# EAGLE design encoder_module_boardedge (EAGLE 6.5.0)
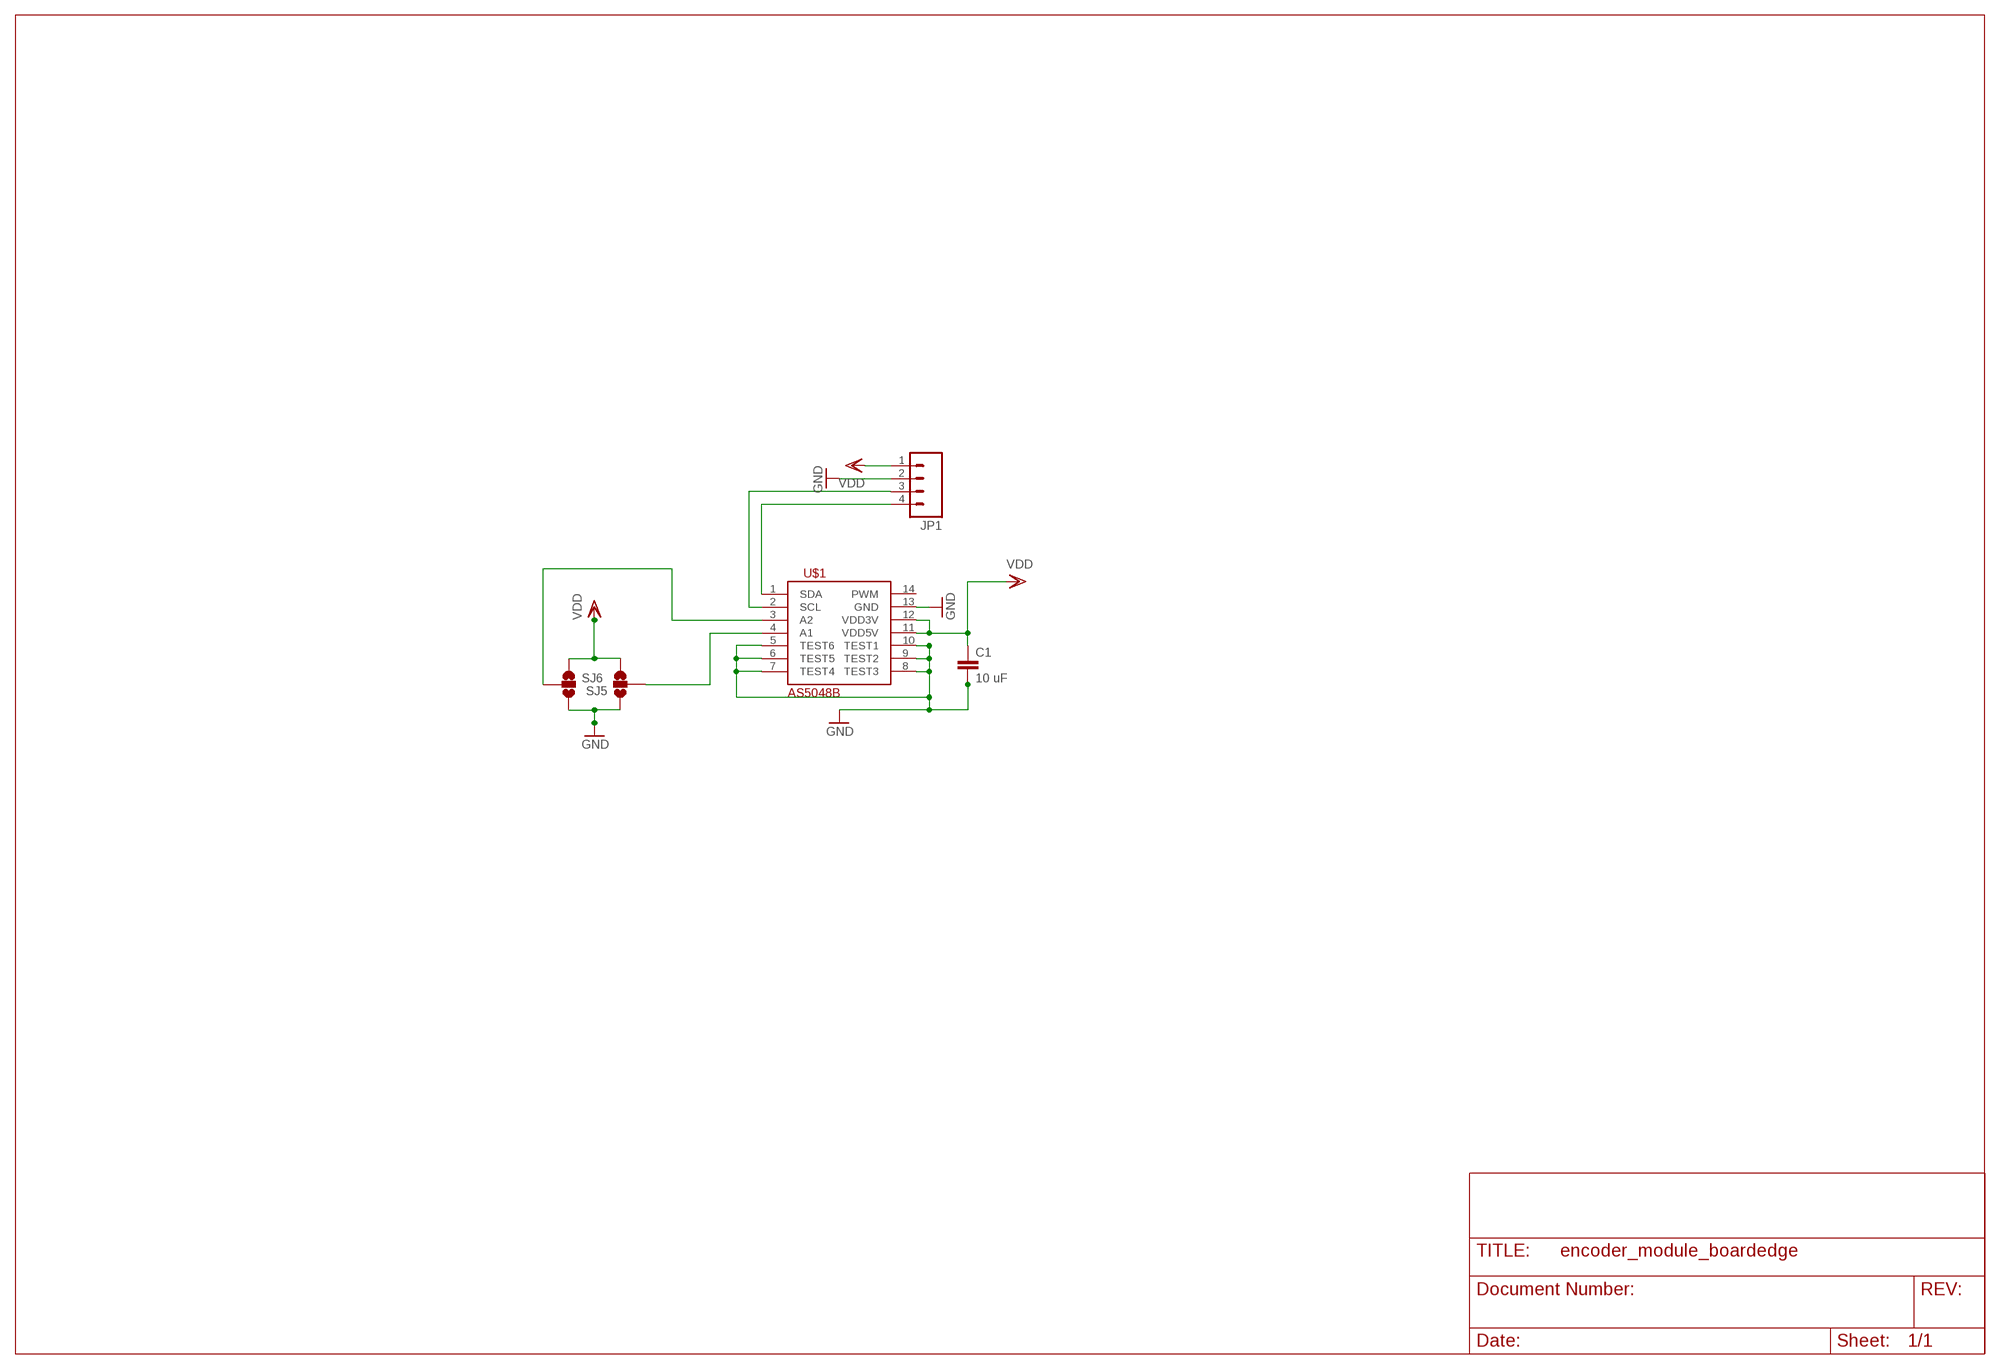
[diagram p0: schematic, sheet 1]

## Parts
C1  10 uF  CAP0603-CAP  [0603-CAP]
JP1  M04BOARDEDGE_VERT_VIA  [1X4_3MM_BOARDEDGE_VERT_VIA]
SJ5  SOLDERJUMPER_2WAYS  [SJ_3]
SJ6  SOLDERJUMPER_2WAYS  [SJ_3]
U$1  AS5048B  [TSSOP14]

## Nets
A1: SJ5.2 U$1.4(A1)
A2: SJ6.2 U$1.3(A2)
GND: C1.2 JP1.2 SJ5.1 SJ6.3 U$1.5(TEST6) U$1.6(TEST5) U$1.7(TEST4) U$1.8(TEST3) U$1.9(TEST2) U$1.10(TEST1) U$1.13(GND)
N$1: JP1.4 U$1.1(SDA)
N$2: JP1.3 U$1.2(SCL)
VDD: C1.1 JP1.1 SJ5.3 SJ6.1 U$1.11(VDD5V) U$1.12(VDD3V)
Unconnected: U$1.14(PWM)

## Library data of the parts
C1 = SparkFun:CAP: Capacitor Standard 0603 ceramic capacitor, and 0.1" leaded capacitor.
JP1 = modular_robotics:M04: Header 4 Standard 4-pin 0.1" header. Use with straight break away headers (SKU : PRT-00116), right angle break away headers (PRT-00553), swiss pins (PRT-00743), machine pins (PRT-00117), and female headers (PRT-00115). Molex polarized connector foot print use with SKU : PRT-08231 with associated crimp pins and housings. 1MM SMD Version SKU: PRT-10208
SJ5 SJ6 = SparkFun:SOLDERJUMPER_2WAY: Solder Jumper 2 way solder jumper
U$1 = austriamicrosystems:AS5048B

## Board
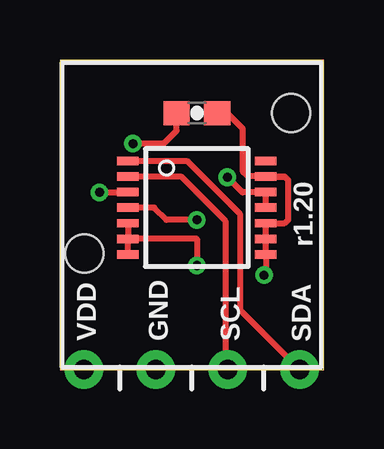
[diagram p1: board, top side]
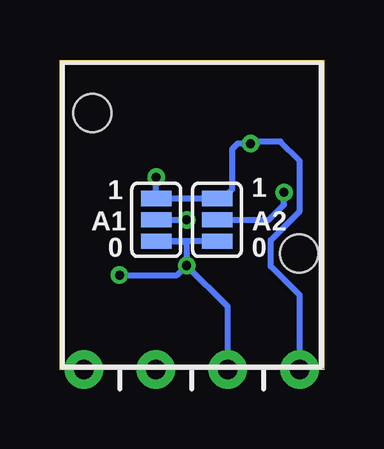
[diagram p2: board, bottom side, seen from below]

Size 11 x 12.9 mm. Coordinates in mm from the lower left corner, seen from the top.
Outline: 0,0 11,0 11,12.9 0,12.9 0,0
Copper layers (1*2+3*16): Top 2mil / dielectric 9mil / Route2 2mil / dielectric 40mil / Route3 2mil / dielectric 9mil / Bottom 2mil
Design rules "advancedcircuits-66each-biomimetic": minimum track width 6mil, minimum drill 15mil, track to track 6mil, track to pad 6mil, pad to pad 6mil, via to via 6mil, smd to smd 6mil, copper to edge 10mil, drill to drill 7mil, minimum pad ring 7mil, minimum via ring 7mil, stop-mask expansion 3mil, vias tented up to drill 0mil, thermal gap 10mil
Holes 1.59 mm at 1.02,4.84 9.65,10.69

### Footprints (pad centres in the part's own frame; a part is rotated, then mirrored left to right if it is on the bottom)
0603-CAP = smd 1.1 x 1: 1 -0.85,0; 2 0.85,0
1X4_3MM_BOARDEDGE_VERT_VIA = drill 0.8 pad 1.6: 1 -4.5,0; 2 -1.5,0; 3 1.5,0; 4 4.5,0
SJ_3 = smd 0.635 x 1.27: 1 -0.889,0; 2 0,0; 3 0.889,0
TSSOP14 = smd 0.9 x 0.35: 1 -2.875,1.95; 2 -2.875,1.3; 3 -2.875,0.65; 4 -2.875,0; 5 -2.875,-0.65; 6 -2.875,-1.3; 7 -2.875,-1.95; 8 2.875,-1.95; 9 2.875,-1.3; 10 2.875,-0.65; 11 2.875,0; 12 2.875,0.65; 13 2.875,1.3; 14 2.875,1.95

### Placement (x,y rotation side)
C1  5.71,10.69 0 top
JP1  5.5,0 0 top
SJ5  6.99,6.24 90 bottom
SJ6  4.45,6.24 270 bottom
U$1  5.71,6.75 0 top

### Tracks (layer width: path | path; a pad name or v marks a point on that pad's centre or on a via)
A1  (via drill 0.38 pad 0.25)
  Top 0.254: v5.71,6.24 4.45,6.24 3.94,6.75 U$1.4
  Bottom 0.254: SJ5.2 v5.71,6.24
A2  (via drill 0.38 pad 0.25)
  Top 0.254: v1.65,7.38 2.83,7.38 U$1.3
  Bottom 0.254: SJ6.2 2.29,6.24 1.65,6.88 v1.65,7.38
GND  (via drill 0.38 pad 0.25)
  Top 0.254: U$1.5 U$1.6 | U$1.7 U$1.6 | U$1.6 5.71,5.45 v5.71,4.33 | 9.4,8.02 9.53,7.89 9.53,6.24 9.38,6.1 U$1.10 U$1.9 U$1.8 8.59,4.01 v8.52,3.94 | 9.4,8.02 8.62,8.02 U$1.13 | U$1.13 9.37,8.05 9.4,8.02 | U$1.13 7.84,8.05 7.62,8.27 7.62,10.05 6.99,10.69 C1.2
  Bottom 0.254: SJ6.3 SJ5.1 5.84,5.35 5.71,5.22 v5.71,4.33 | JP1.2 4,2.62 v5.71,4.33 | v8.52,3.94 6.12,3.94 v5.71,4.33
N$1
  Top 0.254: U$1.1 5.3,8.7 7.5,6.5 7.5,2.5 JP1.4
N$2
  Top 0.254: U$1.2 5.05,8.05 6.9,6.2 6.9,0.1 JP1.3
VDD  (via drill 0.38)
  Top 0.254: U$1.11 U$1.12 8.57,7.38 7.62,7.38 v6.99,8.02 | v3.05,9.41 4.32,9.41 4.87,9.96 C1.1
  Bottom 0.254: v6.99,8.02 SJ5.3 SJ6.1 4.19,7.13 3.81,7.51 3.81,9.19 3.59,9.41 v3.05,9.41 2.96,9.5 1.8,9.5 1,8.7 1,6.6 2.2,5.4 2.2,4.3 1,3.1 JP1.1

### Text on the board
tPlace: r1.20 | VDD | GND | SCL | SDA
bPlace: 1 | 1 | A2 | A1 | 0 | 0